# EasyEDA Pro project fountain.eprj

# Schematic Schematic1
Board Name: Board1; Create Date: 2026-05-14; Page Name: P1; Project Name: fountain; Schematic Name: Schematic1; Update Date: 2026-05-17; Company: EasyEDA.com; Page Size: A4; Version: V1.0
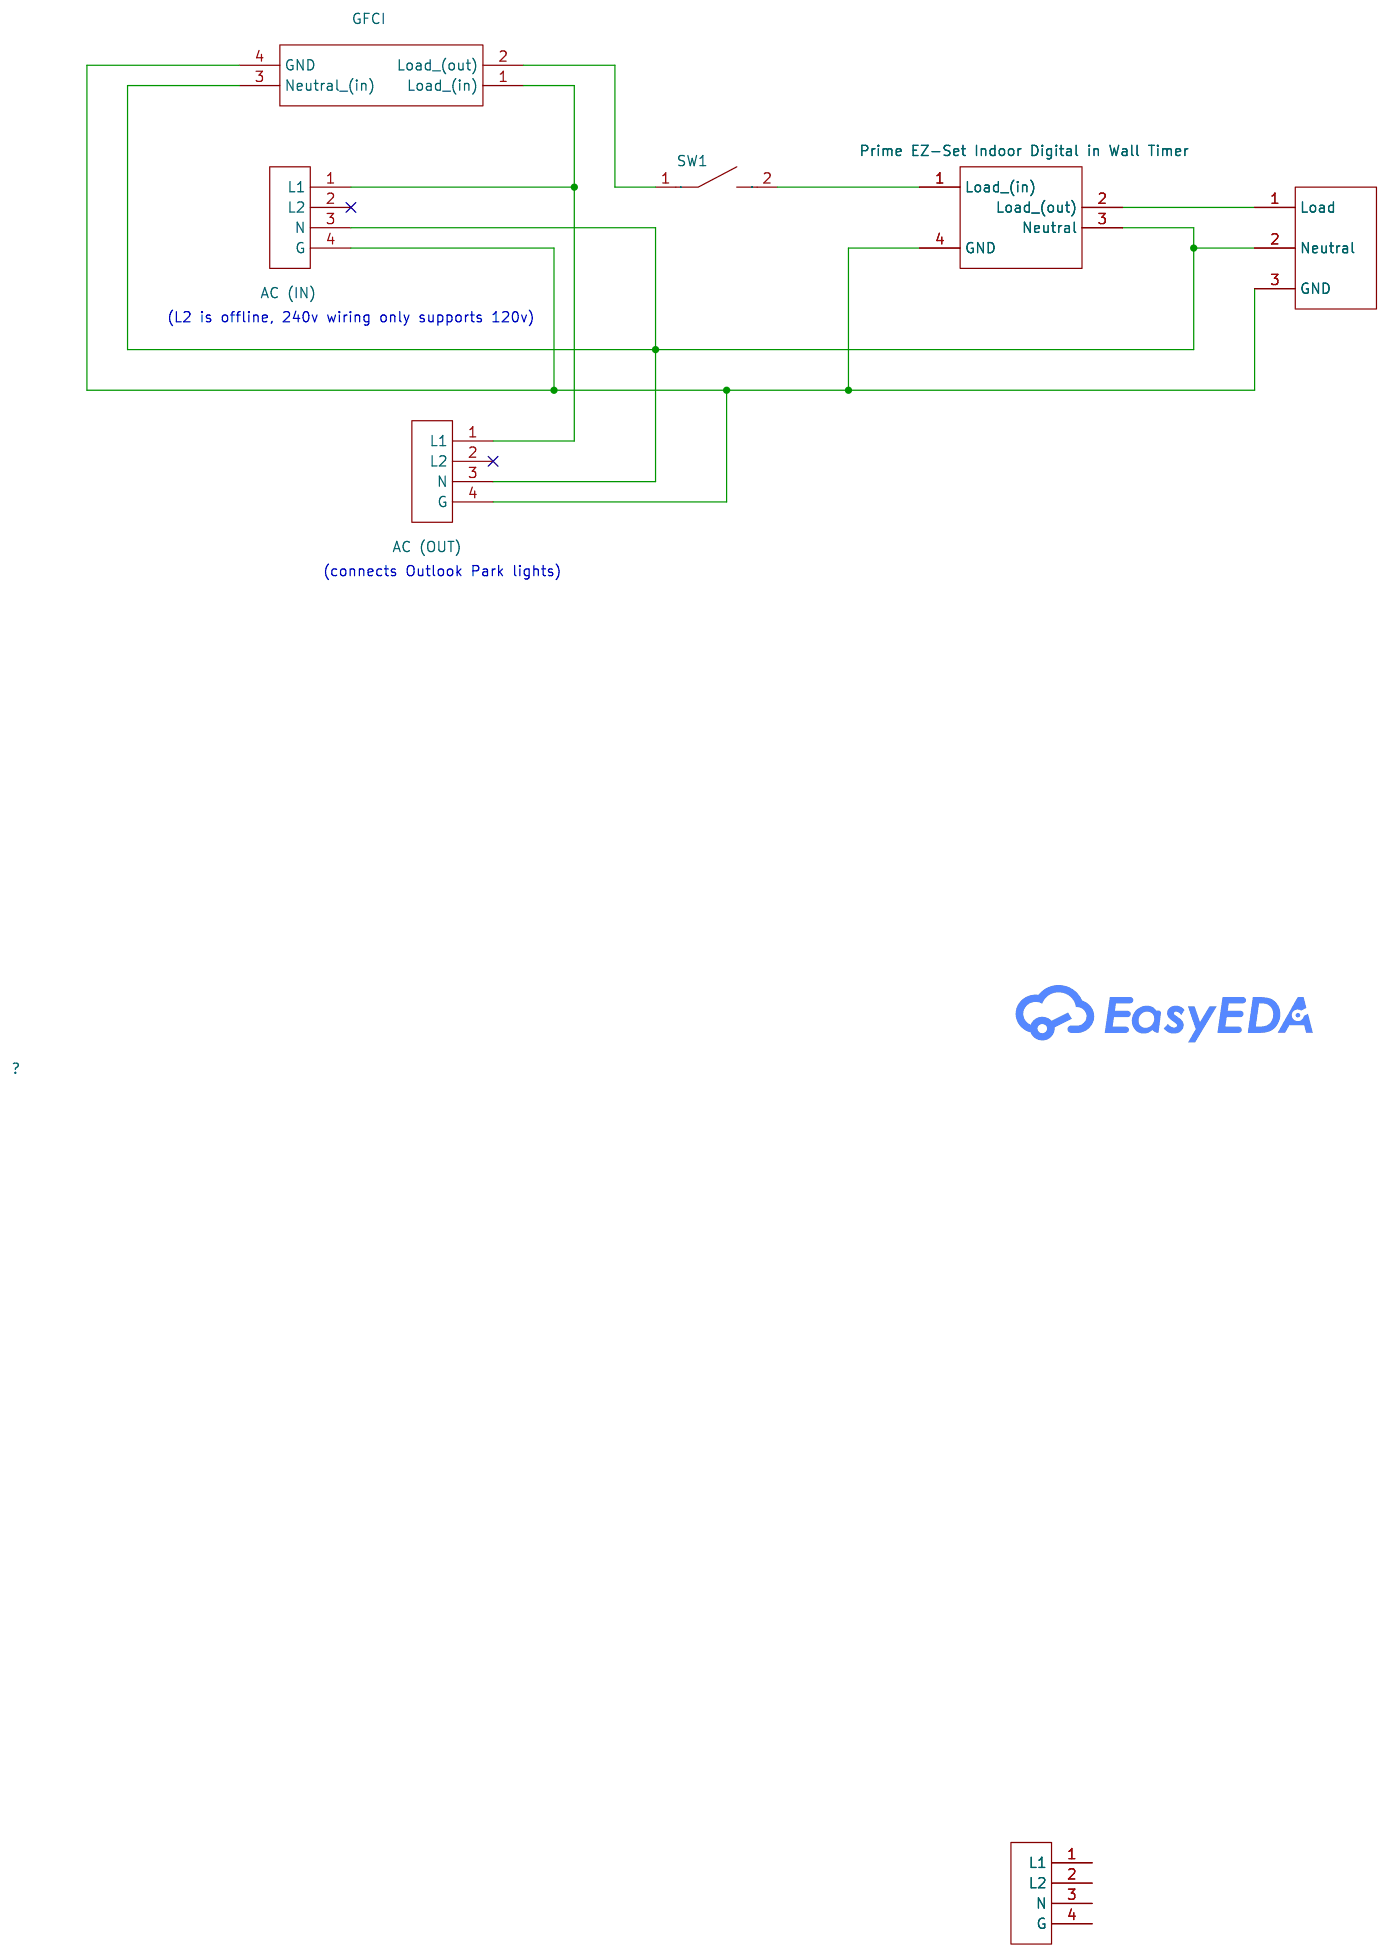
[diagram p0: schematic sheet]

## Parts
GFCI  -  [gfci]
Pump  -  [pump]
SW1  FG-RS601A-1010013BB-6A  [SW-TH_FG-RS601A-1010013BB-6A]
U1  Prime EZ-Set Indoor Digital in Wall Timer  [pump_controller]
W  -  [ACwires]
W1  AC (OUT)  [ACwires]
W?#1  AC (IN)  [ACwires]

## Library data of the parts
GFCI = GFCI
Pump = pump
SW1 = FG-RS601A-1010013BB-6A: Supplier Part: C54529748; Manufacturer: FG(富港); Supplier Footprint: 插件; JLCPCB Part Class: Extended Part; Datasheet: https://item.szlcsc.com/datasheet/FG-RS601A-1010013BB-6A/57881949.html; Supplier: LCSC
U1 = Pump_Controller
W = AC-wires
W1 W?#1 = ACwires

## Nets
Net-(GFCI-1): GFCI.1(Load (in)) W1.1(L1) W?#1.1(L1)
Net-(GFCI-2): GFCI.2(Load (out)) SW1.1
Net-(GFCI-3): GFCI.3(Neutral (in)) Pump.2(Neutral) U1.3(Neutral) W1.3(N) W?#1.3(N)
Net-(GFCI-4): GFCI.4(GND) Pump.3(GND) U1.4(GND) W1.4(G) W?#1.4(G)
Net-(Pump-1): Pump.1(Load) U1.2(Load (out))
Net-(SW1-2): SW1.2 U1.1(Load (in))

Not connected (* = marked no-connect by the designer): W 1(L1) 2(L2) 3(N) 4(G); W1 2(L2)*; W?#1 2(L2)*

## Notes on the sheet
- (L2 is offline, 240v wiring only supports 120v)
- (connects Outlook Park lights)
